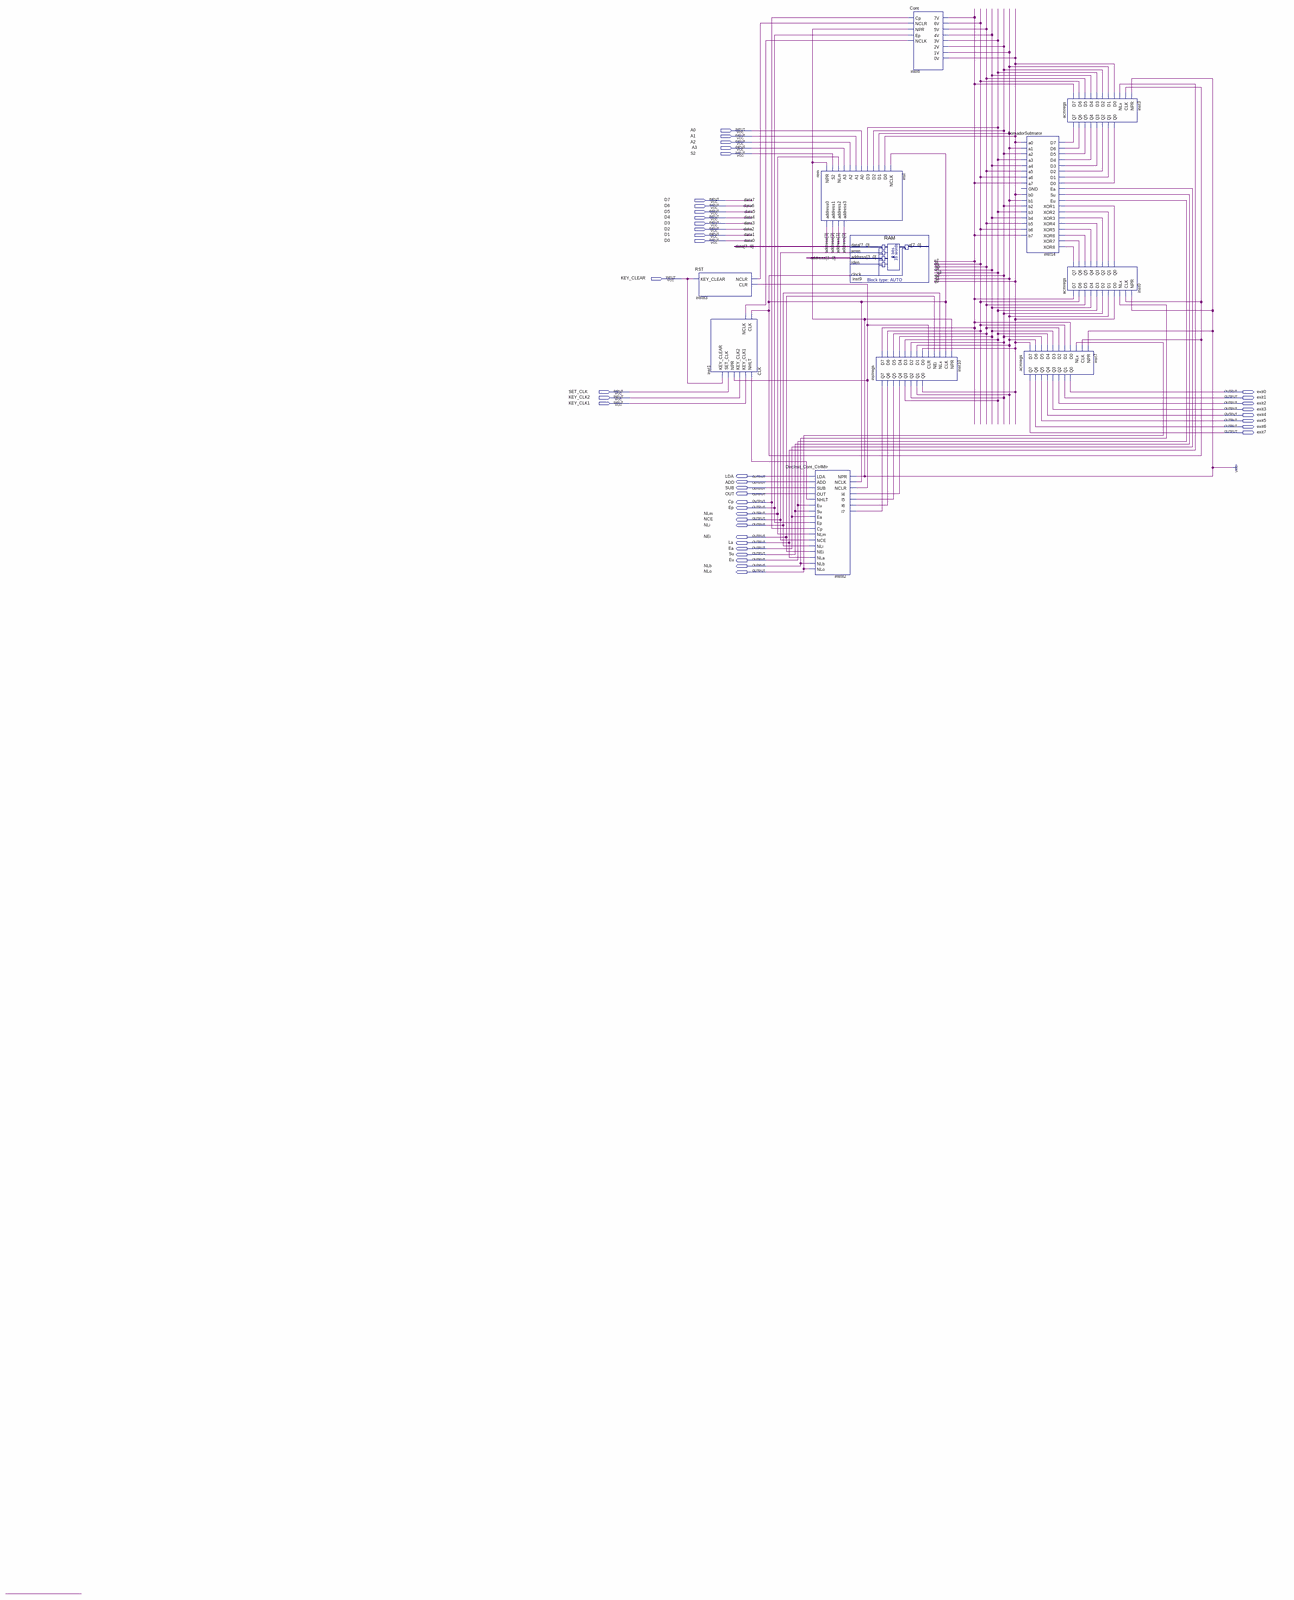
[diagram p0: schematic sheet, whole]
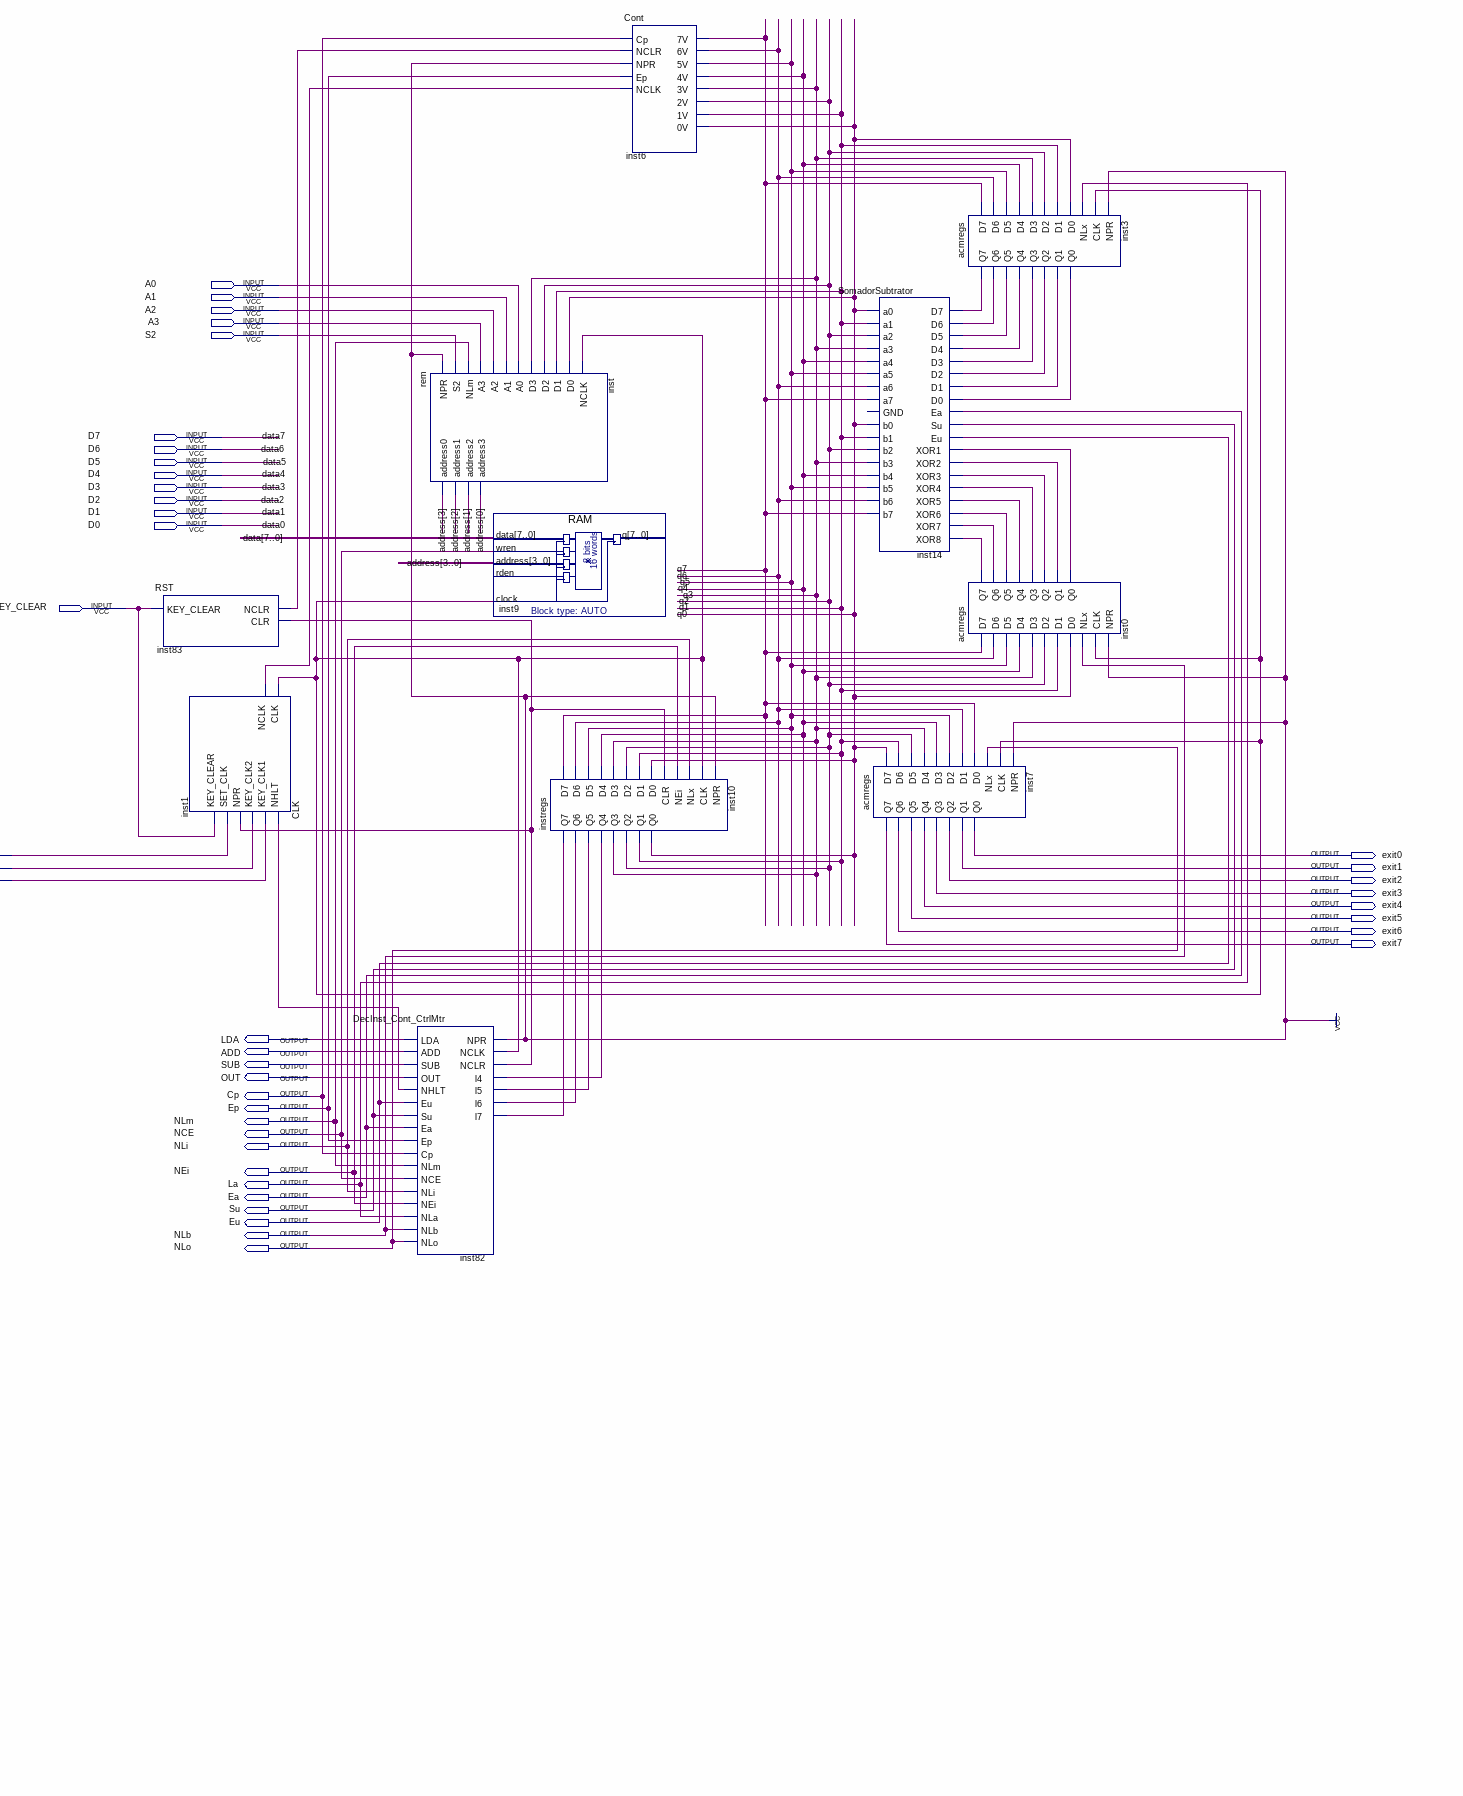
[diagram p1: schematic sheet, upper right part]
// Quartus schematic uC.bdf as structural Verilog: 11 symbols, 41 pins
module uC (
  input  A0,
  input  A1,
  input  A2,
  input  A3,
  input  S2,
  input  D7,
  input  D6,
  input  D5,
  input  D4,
  input  D3,
  input  D2,
  input  D1,
  input  D0,
  input  KEY_CLEAR,
  input  SET_CLK,
  input  KEY_CLK2,
  input  KEY_CLK1,
  output exit0,
  output exit1,
  output exit2,
  output exit3,
  output exit4,
  output exit5,
  output exit6,
  output exit7,
  output LDA,
  output ADD,
  output SUB,
  output OUT,
  output Cp,
  output Ep,
  output NLm,
  output NCE,
  output NLi,
  output NEi,
  output La,
  output Ea,
  output Su,
  output Eu,
  output NLb,
  output NLo
);

  wire inst0_q0, inst0_q1, inst0_q2, inst0_q3, inst0_q4, inst0_q5, inst0_q6, inst0_q7, inst1_clk, inst1_nclk,
       inst3_q0, inst3_q1, inst3_q2, inst3_q3, inst3_q4, inst3_q5, inst3_q6, inst3_q7, inst10_q4, inst10_q5,
       inst10_q6, inst10_q7, inst82_nhlt, inst83_clr, inst83_nclr, q0, q1, q2, q3, q4, q5, q6, q7;
  wire [3:0] address;

  RST inst83 (.KEY_CLEAR(KEY_CLEAR), .NCLR(inst83_nclr), .CLR(inst83_clr));
  CLK inst1 (
    .NHLT(inst82_nhlt), .KEY_CLK1(KEY_CLK1), .KEY_CLK2(KEY_CLK2), .NPR(inst83_clr), .SET_CLK(SET_CLK),
    .KEY_CLEAR(KEY_CLEAR), .CLK(inst1_clk), .NCLK(inst1_nclk));
  rem inst (
    .NPR(1'b1), .S2(S2), .NLm(NLm), .A3(A3), .A2(A2), .A1(A1), .A0(A0), .D3(q3), .D2(q2), .D1(q1), .D0(q0),
    .NCLK(inst1_clk), .address0(address[3]), .address1(address[2]), .address2(address[1]),
    .address3(address[0]));
  DecInst_Cont_CtrlMtr inst82 (
    .NPR(1'b1), .NCLK(inst1_clk), .NCLR(inst83_clr), .l4(inst10_q4), .l5(inst10_q5), .l6(inst10_q6),
    .l7(inst10_q7), .LDA(LDA), .ADD(ADD), .SUB(SUB), .OUT(OUT), .NHLT(inst82_nhlt), .Eu(Eu), .Su(Su),
    .Ea(Ea), .Ep(Ep), .Cp(Cp), .NLm(NLm), .NCE(NCE), .NLi(NLi), .NEi(NEi), .NLa(La), .NLb(NLb), .NLo(NLo));
  RAM inst9 (
    .data({D7, D6, D5, D4, D3, D2, D1, D0}), .wren(NCE), .address(address), .clock(inst1_clk));  // open: rden, q
  instregs inst10 (
    .D7(q7), .D6(q6), .D5(q5), .D4(q4), .D3(q3), .D2(q2), .D1(q1), .D0(q0), .CLR(inst83_clr), .NEi(NEi),
    .NLx(NLi), .CLK(inst1_clk), .NPR(1'b1), .Q7(inst10_q7), .Q6(inst10_q6), .Q5(inst10_q5), .Q4(inst10_q4),
    .Q3(q3), .Q2(q2), .Q1(q1), .Q0(q0));
  Cont inst6 (
    .Cp(Cp), .NCLR(inst83_nclr), .NPR(1'b1), .Ep(Ep), .NCLK(inst1_nclk), .\7V (q7), .\6V (q6), .\5V (q5),
    .\4V (q4), .\3V (q3), .\2V (q2), .\1V (q1), .\0V (q0));
  SomadorSubtrator inst14 (
    .D7(inst3_q7), .D6(inst3_q6), .D5(inst3_q5), .D4(inst3_q4), .D3(inst3_q3), .D2(inst3_q2), .D1(inst3_q1),
    .D0(inst3_q0), .Ea(Ea), .Su(Su), .Eu(Eu), .XOR1(inst0_q0), .XOR2(inst0_q1), .XOR3(inst0_q2),
    .XOR4(inst0_q3), .XOR5(inst0_q4), .XOR6(inst0_q5), .XOR7(inst0_q6), .XOR8(inst0_q7), .a0(q0), .a1(q1),
    .a2(q2), .a3(q3), .a4(q4), .a5(q5), .a6(q6), .a7(q7), .b0(q0), .b1(q1), .b2(q2), .b3(q3), .b4(q4),
    .b5(q5), .b6(q6), .b7(q7));  // open: GND
  acmregs inst7 (
    .D7(q0), .D6(q1), .D5(q2), .D4(q3), .D3(q4), .D2(q5), .D1(q6), .D0(q7), .NLx(NLo), .CLK(inst1_clk),
    .NPR(1'b1), .Q7(exit7), .Q6(exit6), .Q5(exit5), .Q4(exit4), .Q3(exit3), .Q2(exit2), .Q1(exit1), .Q0(exit0));
  acmregs inst3 (
    .D7(q7), .D6(q6), .D5(q5), .D4(q4), .D3(q3), .D2(q2), .D1(q1), .D0(q0), .NLx(La), .CLK(inst1_clk),
    .NPR(1'b1), .Q7(inst3_q7), .Q6(inst3_q6), .Q5(inst3_q5), .Q4(inst3_q4), .Q3(inst3_q3), .Q2(inst3_q2),
    .Q1(inst3_q1), .Q0(inst3_q0));
  acmregs inst0 (
    .D7(q7), .D6(q6), .D5(q5), .D4(q4), .D3(q3), .D2(q2), .D1(q1), .D0(q0), .NLx(NLb), .CLK(inst1_clk),
    .NPR(1'b1), .Q7(inst0_q7), .Q6(inst0_q6), .Q5(inst0_q5), .Q4(inst0_q4), .Q3(inst0_q3), .Q2(inst0_q2),
    .Q1(inst0_q1), .Q0(inst0_q0));

  // Other names for the same wires on the sheet: data[7:0] = {D7, D6, D5, D4, D3, D2, D1, D0}; data0 = D0; data1 = D1;
  //   data2 = D2; data3 = D3; data4 = D4; data5 = D5; data6 = D6; data7 = D7
endmodule
